# EAGLE design ozino.xyz.blue (EAGLE 8.1.1)
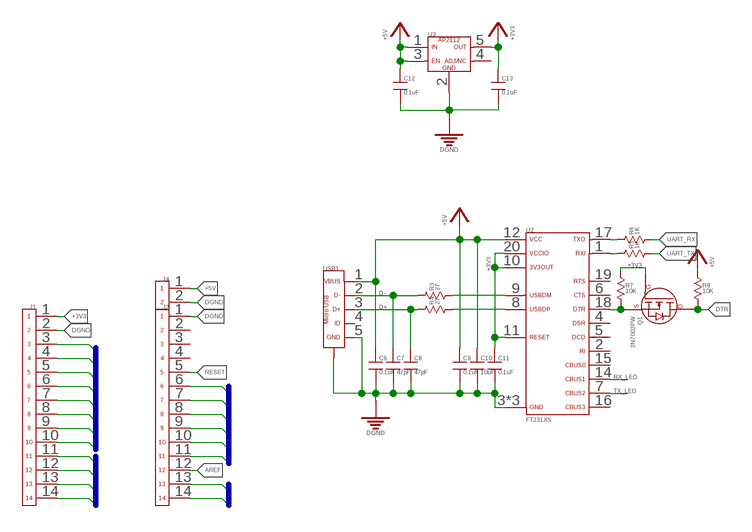
[diagram p0: schematic, sheet 1, part 1 of 2]
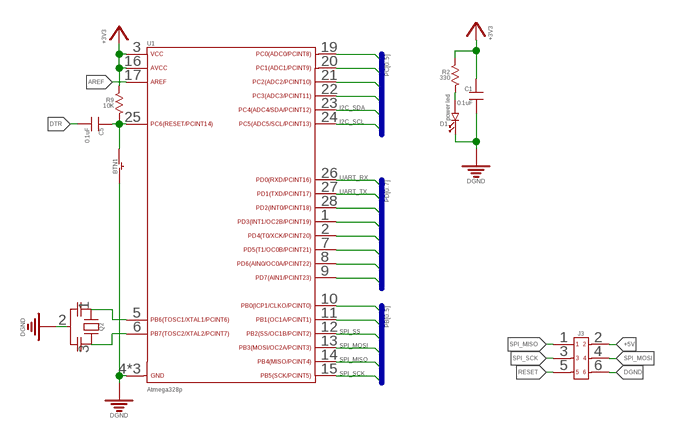
[diagram p1: schematic, sheet 1, part 2 of 2]

## Parts
BTN1  BTN_NORMAL_OFF_6_3.5_SMD  [BTN_6_3.5_SMD]
C1  0.1uF  CAPACITOR_FIXED_0402  [0402]
C5  0.1uF  CAPACITOR_FIXED_0402  [0402]
C6  0.1uF  CAPACITOR_FIXED_0402  [0402]
C7  47pF  CAPACITOR_FIXED_0402  [0402]
C8  47pF  CAPACITOR_FIXED_0402  [0402]
C9  0.1uF  CAPACITOR_FIXED_0402  [0402]
C10  10uF  CAPACITOR_FIXED_0402  [0402]
C11  0.1uF  CAPACITOR_FIXED_0402  [0402]
C12  0.1uF  CAPACITOR_FIXED_0402  [0402]
C13  0.1uF  CAPACITOR_FIXED_0402  [0402]
D1  power led  LED-0805  [0805DIODE]
J1  14PIN_HEADER_PITCH2.54MM_TH  [14PIN_HEADER_PITCH2.54MM_TH]
J2  14PIN_HEADER_PITCH2.54MM_TH  [14PIN_HEADER_PITCH2.54MM_TH]
J3  6PIN_2ROW_TC2030_NL  [TC2030_NL]
J4  2PIN_HEADER_PITCH2.54MM_TH  [2PIN_HEADER_PITCH2.54MM_TH]
Q1  2N7002PW  [SOT323(SC-70)]
Q2  RESONATORS  [CXTCE_____V]
R2  330  RESISTOR_0805  [0805]
R3  27  RESISTOR_0402  [0402]
R4  27  RESISTOR_0402  [0402]
R5  1K  RESISTOR_0402  [0402]
R6  1K  RESISTOR_0402  [0402]
R7  10K  RESISTOR_0402  [0402]
R8  10K  RESISTOR_0402  [0402]
R9  10K  RESISTOR_0402  [0402]
U1  Atmega328p  ATMEGA48A/PA/88A/PA/168A/PA/328/P(28PIN)_28QFN  [QFN-28]
U2  FT231XS_WFQFN20  [WFQFN-20]
U3  AP2112K_SOT-23-5  [SOT-23-5]
USB1  USB-2.0-MICRO_SMD_SMD  [MICRO-USB-B-SMD-SMD]

## Nets
+3V3: C1.1 C11.1 C13.1 J1.1 Q1.1(G) R2.1 R7.1 R9.1 U1.3(VCC) U1.16(AVCC) U2.10(3V3OUT) U2.11(RESET) U2.20(VCCIO) U3.5
+5V: C6.1 C9.1 C10.1 C12.1 J3.2 J4.1 R8.1 U2.12(VCC) U3.1 U3.3 USB1.1(VBUS)
AREF: J2.12 U1.17(AREF)
D+: C8.1 R4.1 USB1.3(D+)
D-: C7.1 R3.1 USB1.2(D-)
DGND: BTN1.1 C1.2 C6.2 C7.2 C8.2 C9.2 C10.2 C11.2 C12.2 C13.2 D1.1(K) J1.2 J2.1 J3.6 J4.2 Q2.2 U1.4(GND) U1.18(GND) U1.T(GND) U2.3(GND) U2.13(GND) U2.T(GND) U3.2 USB1.5(GND) USB1.M1(SHIELD) USB1.M2(SHIELD) USB1.M3(SHIELD) USB1.M4(SHIELD) USB1.S1(SHIELD) USB1.S2(SHIELD)
DTR: C5.2 Q1.3(D) R8.2
I2C_SCL: J2.6 U1.24(PC5)
I2C_SDA: J2.7 U1.23(PC4)
N$1: R3.2 U2.9(USBDM)
N$3: R4.2 U2.8(USBDP)
N$5: R6.1 U2.17(TXD)
N$6: R5.1 U2.1(RXD)
N$7: Q2.1 U1.5(PB6)
N$8: Q2.3 U1.6(PB7)
N$9: Q1.2(S) R7.2 U2.18(DTR)
N$10: D1.2(A) R2.2
PB0: J1.11 U1.10(PB0)
PB1: J1.12 U1.11(PB1)
PC0: J2.11 U1.19(PC0)
PC1: J2.10 U1.20(PC1)
PC2: J2.9 U1.21(PC2)
PC3: J2.8 U1.22(PC3)
PD2: J1.5 U1.28(PD2)
PD3: J1.6 U1.1(PD3)
PD4: J1.7 U1.2(PD4)
PD5: J1.8 U1.7(PD5)
PD6: J1.9 U1.8(PD6)
PD7: J1.10 U1.9(PD7)
RESET: BTN1.2 C5.1 J2.5 J3.5 R9.2 U1.25(PC6)
RX_LED: U2.14(CBUS1)
SPI_MISO: J2.14 J3.1 U1.14(PB4)
SPI_MOSI: J1.14 J3.4 U1.13(PB3)
SPI_SCK: J2.13 J3.3 U1.15(PB5)
SPI_SS: J1.13 U1.12(PB2)
TX_LED: U2.7(CBUS2)
UART_RX: J1.3 R6.2 U1.26(PD0)
UART_TX: J1.4 R5.2 U1.27(PD1)
Unconnected: J2.2 J2.3 J2.4 U2.2(RI) U2.4(DSR) U2.5(DCD) U2.6(CTS) U2.15(CBUS0) U2.16(CBUS3) U2.19(RTS) U3.4 USB1.4(ID)

## Buses
PB[0..5]
PD[0..7]
PC[0..5]
PB[0..3]
PB[4..5]

## Library data of the parts
BTN1 = Switches:BTN_NORMAL_OFF
C1 C5-C13 = Capacitors:CAPACITOR_FIXED
D1 = LEDs:LED
J1 J2 = Connectors:14PIN
J3 = Connectors:6PIN_2ROW
J4 = Connectors:2PIN
Q1 = FETs:2N7002PW
Q2 = Crystals:RESONATORS
R2-R9 = Resistors:RESISTOR
U1 = MCUs:ATMEGA48A/PA/88A/PA/168A/PA/328/P(28PIN)
U2 = FTDI:FT231XS
U3 = Power Supplies:AP2112K
USB1 = Connectors:USB-2.0-MICRO

## Board
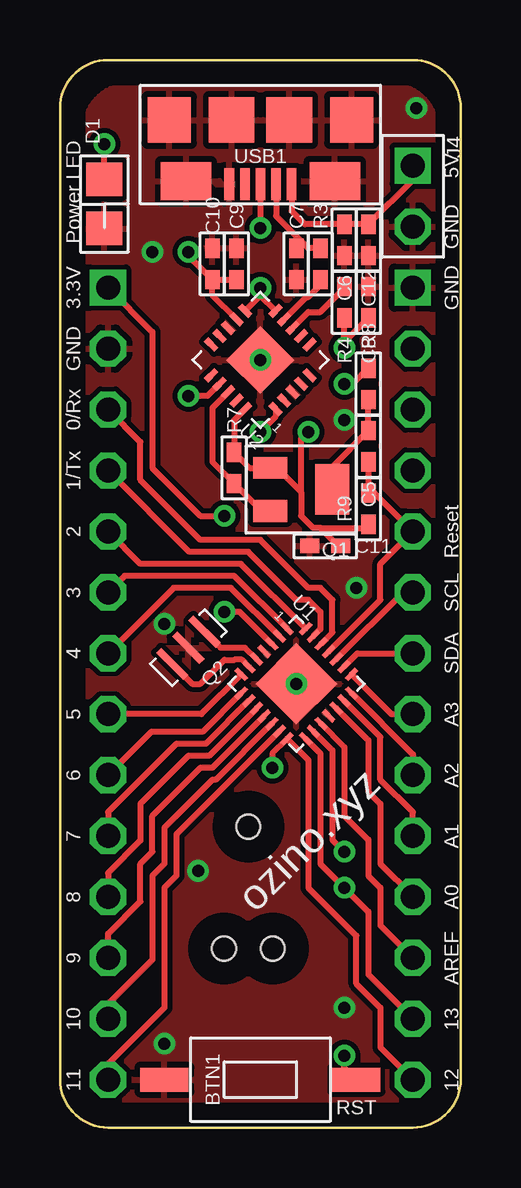
[diagram p2: board, top side]
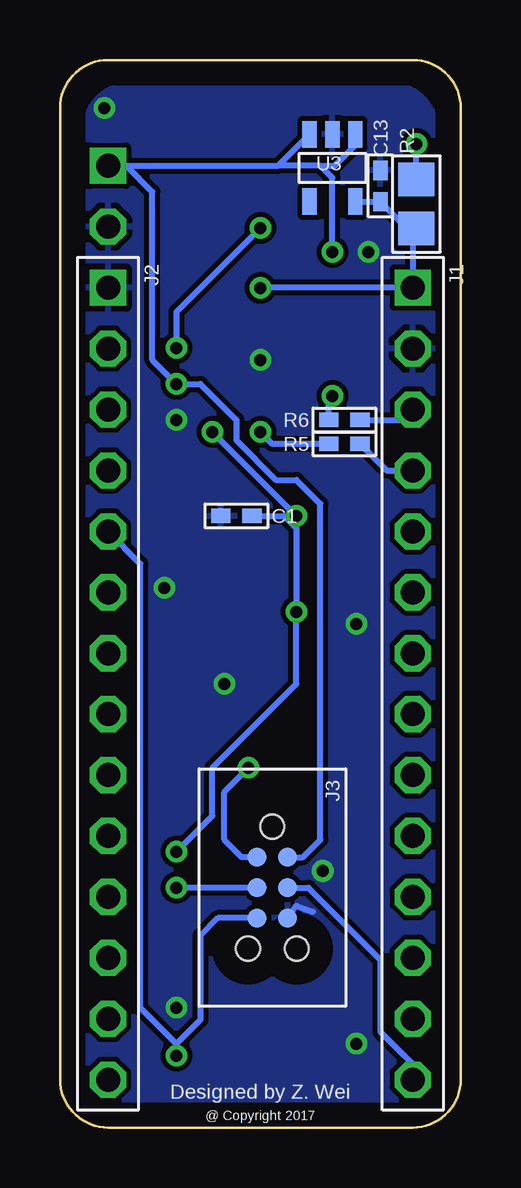
[diagram p3: board, bottom side, seen from below]

Size 16.7 x 44.5 mm. Coordinates in mm from the lower left corner, seen from the top.
Outline: 0,42.5 0,2 arc90 2,0 14.7,0 arc90 16.7,2 16.7,42.5 arc90 14.7,44.5 2,44.5 arc90 0,42.5
Copper layers (1*16): Top 0.035mm / dielectric 1.5mm / Bottom 0.035mm
Design rules "default *": minimum track width 10mil, minimum drill 24mil, track to track 8mil, track to pad 8mil, pad to pad 8mil, via to via 8mil, smd to smd 8mil, copper to edge 1mm, drill to drill 8mil, minimum pad ring 10mil, minimum via ring 8mil, stop-mask expansion 4mil, vias tented up to drill 0mil, thermal gap 10mil

### Footprints (pad centres in the part's own frame; a part is rotated, then mirrored left to right if it is on the bottom)
BTN_6_3.5_SMD = smd 1 x 2: 1 0,4; 2 0,-4
0402 = smd 0.8 x 0.6: 1 -0.65,0; 2 0.65,0
0805DIODE = smd 1.4 x 1.5: 1 -1.025,0; 2 1.025,0
14PIN_HEADER_PITCH2.54MM_TH = drill 1 square: 1 -16.51,0 | drill 1 octagon: 2 -13.97,0; 3 -11.43,0; 4 -8.89,0; 5 -6.35,0; 6 -3.81,0; 7 -1.27,0; 8 1.27,0; 9 3.81,0; 10 6.35,0; 11 8.89,0; 12 11.43,0; 13 13.97,0; 14 16.51,0
TC2030_NL = smd 0.787 x 0.787: 1 -1.27,-0.635; 2 -1.27,0.635; 3 0,-0.635; 4 0,0.635; 5 1.27,-0.635; 6 1.27,0.635 | hole 0.991: -2.54,0; 2.54,1.016; 2.54,-1.016
2PIN_HEADER_PITCH2.54MM_TH = drill 1 square: 1 -1.27,0 | drill 1 octagon: 2 1.27,0
SOT323(SC-70) = smd 1.425 x 0.9: 1 1.288,-0.9; 2 1.288,0.9 | smd 1.425 x 2.1: 3 -1.288,0
CXTCE_____V = smd 0.3 x 1.6: 1 -0.95,0; 2 0,0; 3 0.95,0
0805 = smd 1.4 x 1.5: 1 -1.025,0; 2 1.025,0
QFN-28 = smd 0.6 x 0.2: 1 -1.9,1.35; 2 -1.9,0.9; 3 -1.9,0.45; 4 -1.9,0; 5 -1.9,-0.45; 6 -1.9,-0.9; 7 -1.9,-1.35; 15 1.9,-1.35; 16 1.9,-0.9; 17 1.9,-0.45; 18 1.9,0; 19 1.9,0.45; 20 1.9,0.9; 21 1.9,1.35 | smd 0.2 x 0.6: 8 -1.35,-1.9; 9 -0.9,-1.9; 10 -0.45,-1.9; 11 0,-1.9; 12 0.45,-1.9; 13 0.9,-1.9; 14 1.35,-1.9; 22 1.35,1.9; 23 0.9,1.9; 24 0.45,1.9; 25 0,1.9; 26 -0.45,1.9; 27 -0.9,1.9; 28 -1.35,1.9 | smd 2.4 x 2.4: T 0,0
WFQFN-20 = smd 0.6 x 0.254: 1 -1.9,1; 2 -1.9,0.5; 3 -1.9,0; 4 -1.9,-0.5; 5 -1.9,-1; 11 1.9,-1; 12 1.9,-0.5; 13 1.9,0; 14 1.9,0.5; 15 1.9,1 | smd 0.254 x 0.6: 6 -1,-1.9; 7 -0.5,-1.9; 8 0,-1.9; 9 0.5,-1.9; 10 1,-1.9; 16 1,1.9; 17 0.5,1.9; 18 0,1.9; 19 -0.5,1.9; 20 -1,1.9 | smd 2 x 2: T 0,0
SOT-23-5 = smd 0.6 x 1.1: 1 -0.95,-1.4; 2 0,-1.4; 3 0.95,-1.4; 4 0.95,1.4; 5 -0.95,1.4
MICRO-USB-B-SMD-SMD = smd 0.4 x 1.35: 1 -1.3,2.675; 2 -0.65,2.675; 3 0,2.675; 4 0.65,2.675; 5 1.3,2.675 | smd 2.1 x 1.6: M1 -3.1,2.55; M2 3.1,2.55 | smd 1.8 x 1.9: M3 -3.8,0; M4 3.8,0 | smd 1.9 x 1.9: S1 -1.2,0; S2 1.2,0

### Placement (x,y rotation side)
BTN1  8.35,2 90 top
C1  9.35,25.5 180 bottom
C5  12.85,28.4 90 top
C6  11.85,37 270 top
C7  9.85,36 270 top
C8  12.85,34.4 90 top
C9  7.35,36 90 top
C10  6.35,36 90 top
C11  11.05,24.25 180 top
C12  12.85,37 270 top
C13  3.35,39.25 90 bottom
D1  1.85,38.5 90 top
J1  2,18.5 270 bottom
J2  14.7,18.5 270 bottom
J3  7.85,10 270 bottom
J4  14.7,38.82 270 top
Q1  10.05,26.6 180 top
Q2  5.35,20 225 top
R2  1.85,38.5 90 bottom
R3  10.85,36 270 top
R4  11.85,34.4 90 top
R5  4.85,28.5 0 bottom
R6  4.85,29.5 0 bottom
R7  7.25,27.5 270 top
R8  12.85,31 270 top
R9  12.85,25.8 90 top
U1  9.85,18.5 315 top
U2  8.35,32 135 top
U3  5.35,40 180 bottom
USB1  8.35,42 180 top

### Tracks (layer width: path | path; a pad name or v marks a point on that pad's centre or on a via)
+3V3  (via drill 0.5)
  Top 0.254: U2.11 8.35,34.69 | U2.10 8.35,34.69 | 8.35,34.69 v8.35,35 | U2.20 7.25,29.49 R7.1 7.9,27.5 Q1.1 9.05,27.5 10.05,26.5 | R9.1 12.7,25 10.85,25 | 10.85,25 10.55,25 10.05,25.5 10.05,26.5 | C11.1 11.6,24.25 10.85,25 | U1.3 7.49,21.5 v6.85,21.5 | J1.1 3.85,33.16 3.85,27.5 5.85,25.5 v6.85,25.5 | v10.35,29 10.05,28.7 10.05,26.5 | U1.16 11.35,15.73 11.35,12 v11.85,11.5
  Bottom 0.254: 2,37.25 J1.1 | 2,37.25 2,37.33 R2.1 | U3.5 C13.1 2,37.25 | J1.1 | J1.1 v8.34,35.01 v8.35,35 | v10.35,29 v6.85,25.5 6.85,25 | 6.85,25 v6.85,21.5 6.85,18.5 10.35,15 10.35,13 v11.85,11.5 | C1.1 7.35,25.5 6.85,25
+5V  (via drill 0.5)
  Top 0.254: J4.1 14.7,39.5 C12.1 C6.1 10.2,37.65 9.65,38.2 USB1.1 | U2.12 6.35,34.71 C10.1 | C10.1 C9.1 | R8.1 12.2,31 v11.85,31 | C10.1 5.35,36.35 v5.35,36.5
  Bottom 0.254: 7.61,40.09 J4.1 13.94,40.09 12.85,39 12.85,32 v11.85,31 10.85,31 9.35,29.5 9.35,28.65 7.7,27 6.85,27 5.85,26 5.85,12 6.58,11.27 J3.2 | 7.61,40.09 U3.3 | 5.85,40.09 7.61,40.09 | 5.85,40.09 5.26,40.09 4.4,40.95 U3.1 | v5.35,36.5 5.35,39.59 5.85,40.09
AREF
  Top 0.254: U1.17 11.85,15.86 11.85,13 12.85,12 12.85,10.5 13.35,10 13.35,8.42 J2.12
D+  (via drill 0.5)
  Top 0.254: USB1.3 v8.35,37.5 | R4.1 v11.85,32.5 11.85,32.75 C8.1
  Bottom 0.254: v8.35,37.5 11.85,34 v11.85,32.5
D-
  Top 0.254: USB1.2 9,38 9.67,37.33 | 9.67,37.33 9.85,37.15 C7.1 | R3.1 10.35,36.65 9.67,37.33
DGND  (via drill 0.5)
  Bottom 0.254: J3.6 6.85,9.25 6.15,9
  other vias: 4.35,3.5 14.85,42.5 11.85,5 3.85,36.5 12.35,22.5 4.35,21 9.85,18.5 11.85,29.5 8.35,32 5.75,10.7
  pour Bottom: 15.7,41.5 15.7,3 arc-90 13.7,1 3,1 arc-90 1,3 1,41.5 arc-90 3,43.5 13.7,43.5 arc-90
  pour Top: 15.7,41.5 15.7,3 arc-90 13.7,1 3,1 arc-90 1,3 1,41.5 arc-90 3,43.5 13.7,43.5 arc-90
DTR
  Top 0.254: R8.2 C5.2 11.34,27.54 Q1.3
I2C_SCL
  Top 0.254: U1.24 14.3,22.31 J2.6
I2C_SDA
  Top 0.254: U1.23 12.39,19.77 J2.7
N$1
  Top 0.254: U2.9 10.26,34.62 10.35,34.62 10.85,35.12 R3.2
N$3
  Top 0.254: U2.8 10.35,34 10.85,34 11.85,35 R4.2
N$5  (via drill 0.5)
  Top 0.254: U2.17 6.14,30.5 v5.35,30.5
  Bottom 0.254: R6.1 5.5,30.35 v5.35,30.5
N$6  (via drill 0.5)
  Top 0.254: U2.1 8.99,29.64 v8.35,29
  Bottom 0.254: R5.1 7.85,28.5 v8.35,29
N$7
  Top 0.254: Q2.1 6.69,20 7.71,20 U1.5
N$8
  Top 0.254: U1.6 7.57,19.5 7.27,19.5 6.85,19.5 5.85,18.5 5.51,18.5 Q2.3
N$9
  Top 0.254: U2.18 6.35,30 6.35,27.75 R7.2 8.4,25.7 Q1.2
N$10  (via drill 0.5)
  Top 0.254: R2.2 v1.85,41
  Bottom 0.254: R2.2 v1.85,41
PB0
  Top 0.254: J1.11 2,10.61 3.35,11.96 3.35,13.5 5.35,15.5 6.21,15.5 U1.10
PB1
  Top 0.254: J1.12 2,8.08 3.35,9.43 3.35,11 3.85,11.5 3.85,13 5.85,15 6.35,15 U1.11
PC0
  Top 0.254: U1.19 12.85,16.14 12.85,14 13.35,13.5 13.35,11 14.7,9.65 J2.11
PC1
  Top 0.254: U1.20 13.35,16.27 13.35,14.5 14.7,13.15 J2.10
PC2
  Top 0.254: U1.21 14.7,15.56 J2.9
PC3
  Top 0.254: U1.22 13.81,17.23 J2.8
PD2
  Top 0.254: U1.28 7.54,23.5 3.35,23.5 J1.5
PD3
  Top 0.254: J1.6 2.69,23 7.26,23 U1.1
PD4
  Top 0.254: J1.7 4.73,22.5 7.12,22.5 U1.2
PD5
  Top 0.254: U1.7 5.89,17.23 J1.8
PD6
  Top 0.254: J1.9 3.81,16.5 5.94,16.5 U1.8
PD7
  Top 0.254: U1.9 6.08,16 4.85,16 2,13.15 J1.10
RESET  (via drill 0.5)
  Top 0.254: U1.25 13.35,22 13.35,23.5 J2.5 13.1,26.45 R9.2 C5.1 | BTN1.2 11.85,2.5 v11.85,3
  Bottom 0.254: J3.5 10.12,8.73 10.85,8 10.85,4.5 11.85,3.5 | 11.85,3.5 v11.85,3 | 11.85,3.5 13.35,5 13.35,23.5 J2.5
SPI_MISO  (via drill 0.5)
  Top 0.254: J2.14 13.35,3.34 13.35,5 12.35,6 12.35,8 10.35,10 10.35,15.31 U1.14 8.85,15.59 v8.85,15
  Bottom 0.254: J3.1 9.12,11.27 9.85,12 9.85,14 v8.85,15
SPI_MOSI
  Top 0.254: U1.13 4.85,12.23 4.85,10.5 4.35,10 4.35,5 2,2.65 J1.14
  Bottom 0.254: J1.14 2,2.65 2.35,3 | 2.35,3 3.35,4 | J3.4 6.35,10 3.35,7 3.35,4 | 3.35,4 2.35,3
SPI_SCK  (via drill 0.5)
  Top 0.254: J2.13 12.85,6.38 12.85,9 v11.85,10 10.85,11 10.85,15.59 U1.15
  Bottom 0.254: J3.3 v11.85,10
SPI_SS
  Top 0.254: J1.13 2,5.15 3.85,7 3.85,10.5 4.35,11 4.35,12.5 6.35,14.5 6.49,14.5 U1.12
UART_RX
  Top 0.254: U1.26 11.35,20.64 11.35,22 10.85,22.5 10.35,22.5 8.35,24.5 5.85,24.5 3.35,27 3.35,28.58 J1.3
  Bottom 0.254: R6.2 2.43,29.5 J1.3
UART_TX
  Top 0.254: U1.27 10.85,20.77 10.85,21.5 10.35,22 9.85,22 7.85,24 5.39,24 J1.4
  Bottom 0.254: R5.2 3.09,27.39 J1.4

### Text on the board
tPlace: 5V | Power LED | GND | 3.3V | GND | GND | 0/Rx | 1/Tx | 2 | Reset | 3 | SCL | 4 | SDA | 5 | A3 | 6 | A2 | 7 | ozino.xyz | A1 | 8 | A0 | 9 | AREF | 10 | 13 | 11 | 12 | RST
bPlace: Designed by Z. Wei | @ Copyright 2017